# Altium schematic sheet Sheet1.SchDoc
size A4
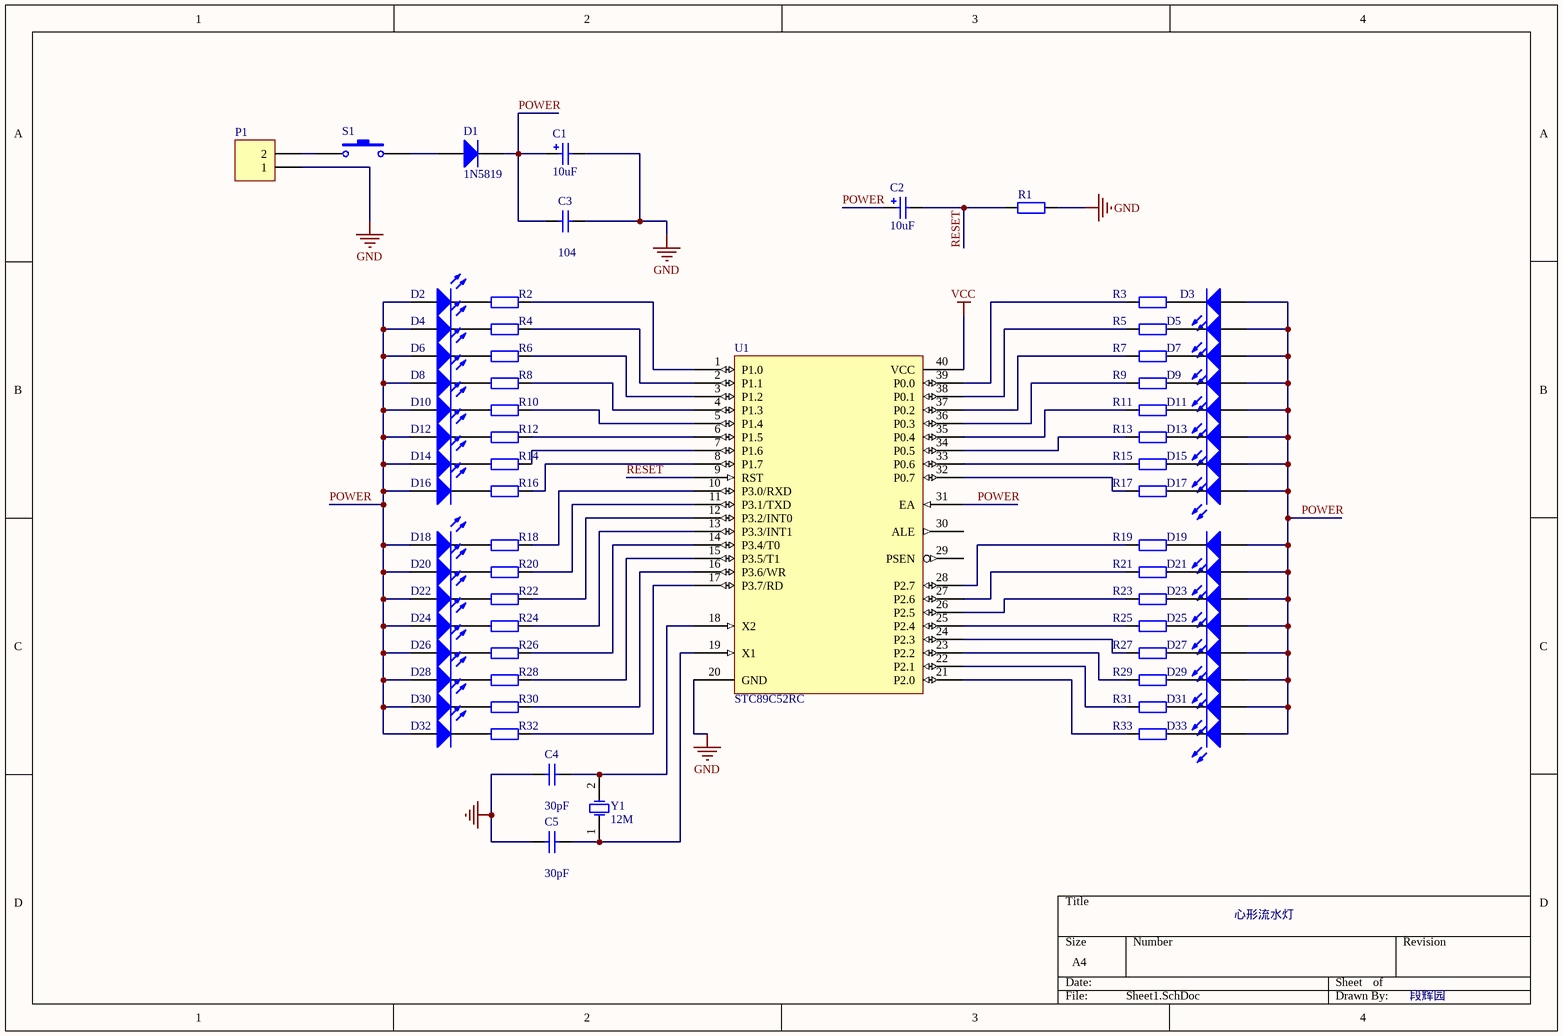
[diagram p0: Sheet1.SchDoc]

## Parts
C1  value 10uF  [RB7.6-15]  (hidden comment: Cap Pol1)
C2  value 10uF  [RB7.6-15]  (hidden comment: Cap Pol1)
C3  value 104  [RAD-0.3]  (hidden comment: Cap)
C4  value 30pF  [RAD-0.3]  (hidden comment: Cap)
C5  value 30pF  [RAD-0.3]  (hidden comment: Cap)
D1  1N5819  [DO-41]
D2  LED0  [LED-0]  (value not drawn)
D3  LED0  [LED-0]  (value not drawn)
D4  LED0  [LED-0]  (value not drawn)
D5  LED0  [LED-0]  (value not drawn)
D6  LED0  [LED-0]  (value not drawn)
D7  LED0  [LED-0]  (value not drawn)
D8  LED0  [LED-0]  (value not drawn)
D9  LED0  [LED-0]  (value not drawn)
D10  LED0  [LED-0]  (value not drawn)
D11  LED0  [LED-0]  (value not drawn)
D12  LED0  [LED-0]  (value not drawn)
D13  LED0  [LED-0]  (value not drawn)
D14  LED0  [LED-0]  (value not drawn)
D15  LED0  [LED-0]  (value not drawn)
D16  LED0  [LED-0]  (value not drawn)
D17  LED0  [LED-0]  (value not drawn)
D18  LED0  [LED-0]  (value not drawn)
D19  LED0  [LED-0]  (value not drawn)
D20  LED0  [LED-0]  (value not drawn)
D21  LED0  [LED-0]  (value not drawn)
D22  LED0  [LED-0]  (value not drawn)
D23  LED0  [LED-0]  (value not drawn)
D24  LED0  [LED-0]  (value not drawn)
D25  LED0  [LED-0]  (value not drawn)
D26  LED0  [LED-0]  (value not drawn)
D27  LED0  [LED-0]  (value not drawn)
D28  LED0  [LED-0]  (value not drawn)
D29  LED0  [LED-0]  (value not drawn)
D30  LED0  [LED-0]  (value not drawn)
D31  LED0  [LED-0]  (value not drawn)
D32  LED0  [LED-0]  (value not drawn)
D33  LED0  [LED-0]  (value not drawn)
P1  Header 2  [HDR1X2]  (value not drawn)
R1  Res2  [AXIAL-0.4]  (value not drawn)
R2  Res2  [AXIAL-0.4]  (value not drawn)
R3  Res2  [AXIAL-0.4]  (value not drawn)
R4  Res2  [AXIAL-0.4]  (value not drawn)
R5  Res2  [AXIAL-0.4]  (value not drawn)
R6  Res2  [AXIAL-0.4]  (value not drawn)
R7  Res2  [AXIAL-0.4]  (value not drawn)
R8  Res2  [AXIAL-0.4]  (value not drawn)
R9  Res2  [AXIAL-0.4]  (value not drawn)
R10  Res2  [AXIAL-0.4]  (value not drawn)
R11  Res2  [AXIAL-0.4]  (value not drawn)
R12  Res2  [AXIAL-0.4]  (value not drawn)
R13  Res2  [AXIAL-0.4]  (value not drawn)
R14  Res2  [AXIAL-0.4]  (value not drawn)
R15  Res2  [AXIAL-0.4]  (value not drawn)
R16  Res2  [AXIAL-0.4]  (value not drawn)
R17  Res2  [AXIAL-0.4]  (value not drawn)
R18  Res2  [AXIAL-0.4]  (value not drawn)
R19  Res2  [AXIAL-0.4]  (value not drawn)
R20  Res2  [AXIAL-0.4]  (value not drawn)
R21  Res2  [AXIAL-0.4]  (value not drawn)
R22  Res2  [AXIAL-0.4]  (value not drawn)
R23  Res2  [AXIAL-0.4]  (value not drawn)
R24  Res2  [AXIAL-0.4]  (value not drawn)
R25  Res2  [AXIAL-0.4]  (value not drawn)
R26  Res2  [AXIAL-0.4]  (value not drawn)
R27  Res2  [AXIAL-0.4]  (value not drawn)
R28  Res2  [AXIAL-0.4]  (value not drawn)
R29  Res2  [AXIAL-0.4]  (value not drawn)
R30  Res2  [AXIAL-0.4]  (value not drawn)
R31  Res2  [AXIAL-0.4]  (value not drawn)
R32  Res2  [AXIAL-0.4]  (value not drawn)
R33  Res2  [AXIAL-0.4]  (value not drawn)
S1  SW-PB  [SPST-2]  (value not drawn)
U1  STC89C52RC  [DIP40 - duplicate]
Y1  12M  [R38]

## Nets
GND: C1.2 C3.2 C4.1 C5.1 P1.1 R1.2 U1.20(GND)
VCC: U1.40(VCC)
POWER: C1.1 C2.1 C3.1 D1.2(K) D2.1(A) D3.1(A) D4.1(A) D5.1(A) D6.1(A) D7.1(A) D8.1(A) D9.1(A) D10.1(A) D11.1(A) D12.1(A) D13.1(A) D14.1(A) D15.1(A) D16.1(A) D17.1(A) D18.1(A) D19.1(A) D20.1(A) D21.1(A) D22.1(A) D23.1(A) D24.1(A) D25.1(A) D26.1(A) D27.1(A) D28.1(A) D29.1(A) D30.1(A) D31.1(A) D32.1(A) D33.1(A) U1.31(EA)
RESET: C2.2 R1.1 U1.9(RST)
NetC4_2: C4.2 U1.18(X2) Y1.2(OSC2)
NetC5_2: C5.2 U1.19(X1) Y1.1(OSC1)
NetD1_1: D1.1(A) S1.2
NetD2_2: D2.2(K) R2.1
NetD3_2: D3.2(K) R3.2
NetD4_2: D4.2(K) R4.1
NetD5_2: D5.2(K) R5.2
NetD6_2: D6.2(K) R6.1
NetD7_2: D7.2(K) R7.2
NetD8_2: D8.2(K) R8.1
NetD9_2: D9.2(K) R9.2
NetD10_2: D10.2(K) R10.1
NetD11_2: D11.2(K) R11.2
NetD12_2: D12.2(K) R12.1
NetD13_2: D13.2(K) R13.2
NetD14_2: D14.2(K) R14.1
NetD15_2: D15.2(K) R15.2
NetD16_2: D16.2(K) R16.1
NetD17_2: D17.2(K) R17.2
NetD18_2: D18.2(K) R18.1
NetD19_2: D19.2(K) R19.2
NetD20_2: D20.2(K) R20.1
NetD21_2: D21.2(K) R21.2
NetD22_2: D22.2(K) R22.1
NetD23_2: D23.2(K) R23.2
NetD24_2: D24.2(K) R24.1
NetD25_2: D25.2(K) R25.2
NetD26_2: D26.2(K) R26.1
NetD27_2: D27.2(K) R27.2
NetD28_2: D28.2(K) R28.1
NetD29_2: D29.2(K) R29.2
NetD30_2: D30.2(K) R30.1
NetD31_2: D31.2(K) R31.2
NetD32_2: D32.2(K) R32.1
NetD33_2: D33.2(K) R33.2
NetP1_2: P1.2 S1.1
NetR2_2: R2.2 U1.1(P1.0)
NetR3_1: R3.1 U1.39(P0.0)
NetR4_2: R4.2 U1.2(P1.1)
NetR5_1: R5.1 U1.38(P0.1)
NetR6_2: R6.2 U1.3(P1.2)
NetR7_1: R7.1 U1.37(P0.2)
NetR8_2: R8.2 U1.4(P1.3)
NetR9_1: R9.1 U1.36(P0.3)
NetR10_2: R10.2 U1.5(P1.4)
NetR11_1: R11.1 U1.35(P0.4)
NetR12_2: R12.2 U1.6(P1.5)
NetR13_1: R13.1 U1.34(P0.5)
NetR14_2: R14.2 U1.7(P1.6)
NetR15_1: R15.1 U1.33(P0.6)
NetR16_2: R16.2 U1.8(P1.7)
NetR17_1: R17.1 U1.32(P0.7)
NetR18_2: R18.2 U1.10(P3.0/RXD)
NetR19_1: R19.1 U1.28(P2.7)
NetR20_2: R20.2 U1.11(P3.1/TXD)
NetR21_1: R21.1 U1.27(P2.6)
NetR22_2: R22.2 U1.12(P3.2/INT0)
NetR23_1: R23.1 U1.26(P2.5)
NetR24_2: R24.2 U1.13(P3.3/INT1)
NetR25_1: R25.1 U1.25(P2.4)
NetR26_2: R26.2 U1.14(P3.4/T0)
NetR27_1: R27.1 U1.24(P2.3)
NetR28_2: R28.2 U1.15(P3.5/T1)
NetR29_1: R29.1 U1.23(P2.2)
NetR30_2: R30.2 U1.16(P3.6/WR)
NetR31_1: R31.1 U1.22(P2.1)
NetR32_2: R32.2 U1.17(P3.7/RD)
NetR33_1: R33.1 U1.21(P2.0)

Not connected (* = marked no-connect by the designer): U1 29(PSEN) 30(ALE)

## Notes on the sheet
- 心形流水灯
- 段辉园

## Library data of the parts
C1 C2 = Cap Pol1: Polarized Capacitor (Radial); Published: 8-Jun-2000; LatestRevisionDate: 17-Jul-2002; LatestRevisionNote: Re-released for DXP Platform.; PackageReference: RB7.6-15; Publisher: Altium Limited; PackageDescription: Polarized Capacitor (Radial); 2 Leads
C3-C5 = Cap: Capacitor; Published: 8-Jun-2000; LatestRevisionDate: 17-Jul-2002; LatestRevisionNote: Re-released for DXP Platform.; PackageReference: RAD-0.3; Publisher: Altium Limited; PackageDescription: Radial Cap, Thru-Hole; 2 Leads; 0.3 in Pin Spacing
D1 = Diode 1N4007: 1 Amp General Purpose Rectifier; Published: 8-Jun-2000; LatestRevisionDate: 17-Jul-2002; LatestRevisionNote: Re-released for DXP Platform.; DatasheetVersion: 1998; PackageVersion: Aug-1999; PackageReference: DO-41; Publisher: Altium Limited; PackageDescription: Diode, Axial; Body 5.2 x 2.7 mm (LxDia. max), Lead Dia. 0.86 mm (max); Code_JEDEC: DO-204-AL; ComponentLink1Description: Manufacturer Link; ComponentLink1URL: http://www.fairchildsemi.com/; ComponentLink2Description: Datasheet; ComponentLink2URL: http://www.fairchildsemi.com/ds/1N%2F1N4001.pdf
D2-D33 = LED0: Typical INFRARED GaAs LED; Published: 8-Jun-2000; LatestRevisionDate: 08-Jul-2005; LatestRevisionNote: Mech Layer 1 removed.; PackageReference: LED-0; Publisher: Altium Limited; PackageDescription: LED; 2 Leads
P1 = Header 2: Header, 2-Pin; LatestRevisionDate: 17-Jul-2002; LatestRevisionNote: Re-released for DXP Platform.; Publisher: Altium Limited
R1-R33 = Res2: Resistor; Value: 1K; Published: 8-Jun-2000; LatestRevisionDate: 17-Jul-2002; LatestRevisionNote: Re-released for DXP Platform.; PackageReference: AXIAL-0.4; Publisher: Altium Limited; PackageDescription: Axial Device, Thru-Hole; 2 Leads; 0.4 in Pin Spacing
S1 = SW-PB: Switch; Published: 24-Mar-1999; LatestRevisionDate: 17-Jul-2002; LatestRevisionNote: Re-released for DXP Platform.; PackageReference: SPST-2; Publisher: Altium Limited; PackageDescription: Switch; 2 Leads
Y1 = XTAL: Crystal Oscillator; Published: 8-Jun-2000; LatestRevisionDate: 17-Jul-2002; LatestRevisionNote: Re-released for DXP Platform.; PackageReference: R38; Publisher: Altium Limited; PackageDescription: Crystal, Thru-Hole; 2 Leads; Body 3.1 x 8.2 mm (Dia.xH)